# EAGLE schematic ir_emitter (EAGLE 9.7.0)
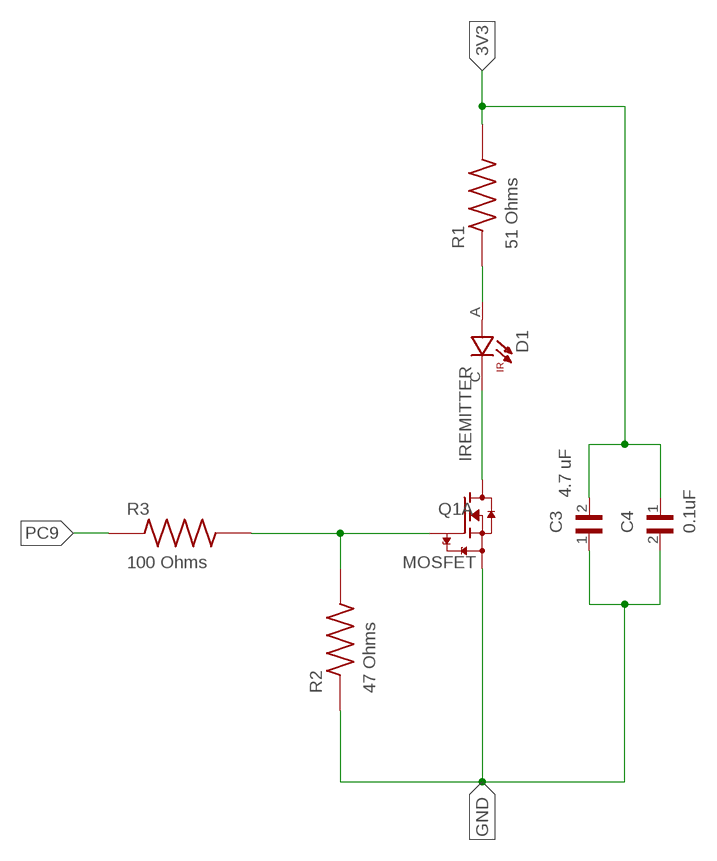
[diagram p0: schematic, sheet 1]

## Parts
C3  4.7 uF  GRM0335C1E100JA01D  [CAPC0603X33N]
C4  0.1uF  CL21B104KCFNNNE  [CAPC2012X140N]
D1  IREMITTER  VSMY2850GX01  [DIO_VSMY2850GX01]
Q1A  MOSFET  NX7002AK,215  [SOT95P230X110-3N]
R1  51 Ohms  RC0805FR-073R48L  [RESC2012X60N]
R2  47 Ohms  RMCF0805JT47R0  [RESC2012X65N]
R3  100 Ohms  RC0805FR-07100RL  [RESC2012X60N]

## Nets
3V3: C3.2 C4.1 R1.2
GND: C3.1 C4.2 Q1A.2(S) R2.1
N$1: D1.A R1.1
N$2: Q1A.1(G) R2.2 R3.2
N$3: D1.C Q1A.3(D)
PC9: R3.1

## Library data of the parts
C3 = Cap4.7uF:GRM0335C1E100JA01D: SMD Capacitor C0G(EIA) with Capacitance: 10pF Tol. 5%. Rated Voltage: 25Vdc
C4 = Cap0-1uF:CL21B104KCFNNNE: CL21 Series 0.1 uF 100V ±10 % Tolerance X7R SMT Multilayer Ceramic Capacitor
D1 = IREmitter:VSMY2850GX01: Infrared Emitters - High Power; MANUFACTURER: VISHAY; MAXIMUM_PACKAGE_HEIGHT: 3.02mm; PARTREV: 1.0; STANDARD: Manufacturer recommendations
Q1A = MOSFET_SMD:NX7002AK,215: N-Channel 60 V 4.5 Ohm 265 mW 0.33 nC Surface Mount Mosfet - SOT-23; MANUFACTURER: Nexperia; MAXIMUM_PACKAGE_HEIGHT: 1.1mm; PARTREV: 7; STANDARD: IPC-7351B
R1 = LEDCurrentResistor51Ohms:RC0805FR-073R48L: Res Thick Film 0805 3.48 Ohm 1% 0.125W(1/8W) ±200ppm/C Epoxy Pad SMD T/R
R2 = Pull-Down Resistor 47 Ohms:RMCF0805JT47R0
R3 = MCU Pin Current Limiter Resistor 100 Ohms:RC0805FR-07100RL: Resistor SMD [YAGEO] RC0805FR-07100RL Resistor SMD